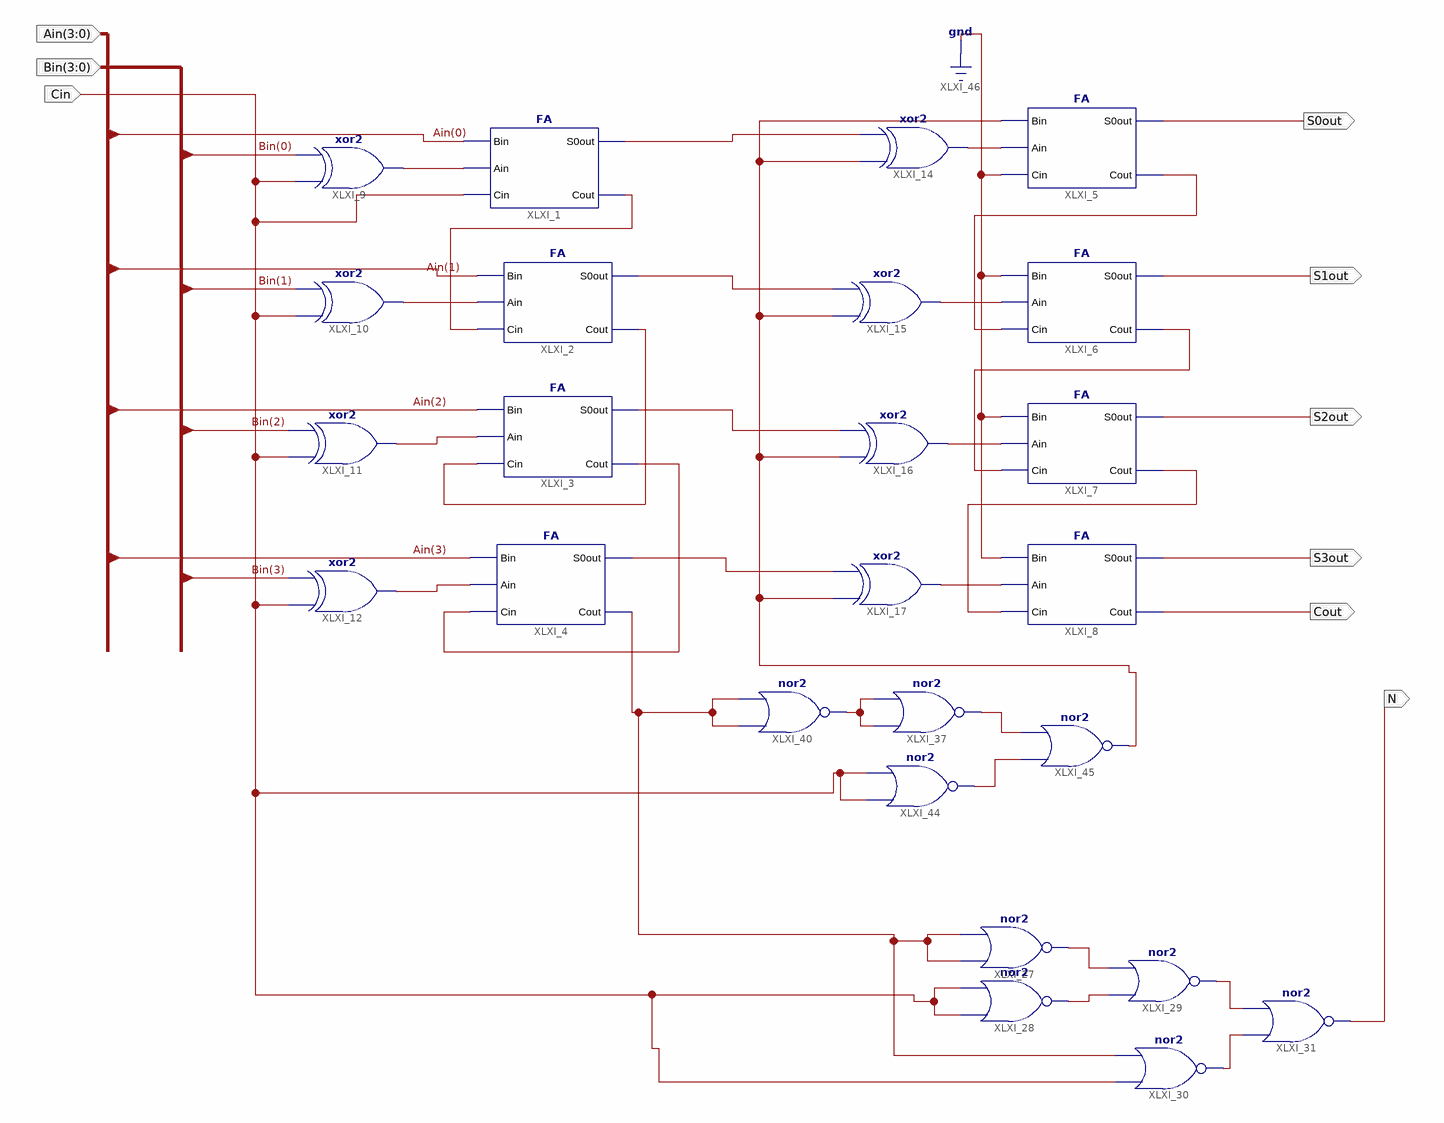
[diagram p0: schematic sheet 1]
// Xilinx ISE schematic experiment3.sch (spartan3e) as structural Verilog: 25 symbols, 9 ports
module experiment3 (
  input  [3:0] Ain,
  input  [3:0] Bin,
  input  Cin,
  output S0out,
  output S1out,
  output S2out,
  output S3out,
  output Cout,
  output N
);

  wire XLXN_1, XLXN_2, XLXN_4, XLXN_5, XLXN_6, XLXN_7, XLXN_17, XLXN_20, XLXN_22, XLXN_24, XLXN_78, XLXN_80,
       XLXN_81, XLXN_82, XLXN_83, XLXN_96, XLXN_99, XLXN_100, XLXN_102, XLXN_103, XLXN_104, XLXN_105,
       XLXN_106, XLXN_107, XLXN_109, XLXN_110, XLXN_111;

  FA XLXI_1 (.Bin(Ain[0]), .Ain(XLXN_17), .Cin(Cin), .S0out(XLXN_103), .Cout(XLXN_1));
  FA XLXI_2 (.Bin(Ain[1]), .Ain(XLXN_20), .Cin(XLXN_1), .S0out(XLXN_105), .Cout(XLXN_2));
  FA XLXI_3 (.Bin(Ain[2]), .Ain(XLXN_22), .Cin(XLXN_2), .S0out(XLXN_106), .Cout(XLXN_4));
  FA XLXI_4 (.Bin(Ain[3]), .Ain(XLXN_24), .Cin(XLXN_4), .S0out(XLXN_107), .Cout(XLXN_78));
  FA XLXI_5 (.Bin(XLXN_102), .Ain(XLXN_104), .Cin(1'b0), .S0out(S0out), .Cout(XLXN_5));
  FA XLXI_6 (.Bin(1'b0), .Ain(XLXN_109), .Cin(XLXN_5), .S0out(S1out), .Cout(XLXN_6));
  FA XLXI_7 (.Bin(1'b0), .Ain(XLXN_110), .Cin(XLXN_6), .S0out(S2out), .Cout(XLXN_7));
  FA XLXI_8 (.Bin(1'b0), .Ain(XLXN_111), .Cin(XLXN_7), .S0out(S3out), .Cout(Cout));
  xor XLXI_9 (XLXN_17, Cin, Bin[0]);
  xor XLXI_10 (XLXN_20, Cin, Bin[1]);
  xor XLXI_11 (XLXN_22, Cin, Bin[2]);
  xor XLXI_12 (XLXN_24, Cin, Bin[3]);
  xor XLXI_14 (XLXN_104, XLXN_102, XLXN_103);
  xor XLXI_15 (XLXN_109, XLXN_102, XLXN_105);
  xor XLXI_16 (XLXN_110, XLXN_102, XLXN_106);
  xor XLXI_17 (XLXN_111, XLXN_102, XLXN_107);
  nor XLXI_27 (XLXN_81, XLXN_78, XLXN_78);
  nor XLXI_28 (XLXN_80, Cin, Cin);
  nor XLXI_29 (XLXN_82, XLXN_80, XLXN_81);
  nor XLXI_30 (XLXN_83, Cin, XLXN_78);
  nor XLXI_31 (N, XLXN_83, XLXN_82);
  nor XLXI_40 (XLXN_96, XLXN_78, XLXN_78);
  nor XLXI_37 (XLXN_100, XLXN_96, XLXN_96);
  nor XLXI_44 (XLXN_99, Cin, Cin);
  nor XLXI_45 (XLXN_102, XLXN_99, XLXN_100);
endmodule
